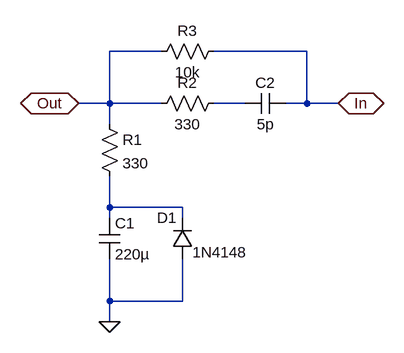
[diagram p0: schematic fb.asc]
fb.asc, the LTspice schematic file:
Version 4
SHEET 1 880 680
WIRE 224 32 144 32
WIRE 448 32 304 32
WIRE 144 112 144 32
WIRE 144 112 96 112
WIRE 224 112 144 112
WIRE 352 112 304 112
WIRE 448 112 448 32
WIRE 448 112 416 112
WIRE 496 112 448 112
WIRE 144 144 144 112
WIRE 144 272 144 224
WIRE 256 272 144 272
WIRE 144 288 144 272
WIRE 256 288 256 272
WIRE 144 416 144 352
WIRE 256 416 256 352
WIRE 256 416 144 416
WIRE 144 448 144 416
FLAG 496 112 In
IOPIN 496 112 BiDir
FLAG 96 112 Out
IOPIN 96 112 BiDir
FLAG 144 448 0
SYMBOL res 128 128 R0
SYMATTR InstName R1
SYMATTR Value 330
SYMBOL cap 128 288 R0
SYMATTR InstName C1
SYMATTR Value 220µ
SYMBOL res 320 96 R90
WINDOW 0 0 56 VBottom 2
WINDOW 3 32 56 VTop 2
SYMATTR InstName R2
SYMATTR Value 330
SYMBOL res 208 48 R270
WINDOW 0 32 56 VTop 2
WINDOW 3 0 56 VBottom 2
SYMATTR InstName R3
SYMATTR Value 10k
SYMBOL cap 416 96 R90
WINDOW 0 0 32 VBottom 2
WINDOW 3 32 32 VTop 2
SYMATTR InstName C2
SYMATTR Value 5p
SYMBOL diode 272 352 R180
WINDOW 0 24 64 Left 2
WINDOW 3 -84 11 Left 2
SYMATTR InstName D1
SYMATTR Value 1N4148

The netlist it stands for:
* fb.asc
R1 Out N002 330
C1 N002 0 220µ
R2 N001 Out 330
R3 Out In 10k
C2 In N001 5p
D1 0 N002 1N4148
.model D D
.lib standard.dio
.backanno
.end